# EAGLE design gimbal (EAGLE 6.5.0)
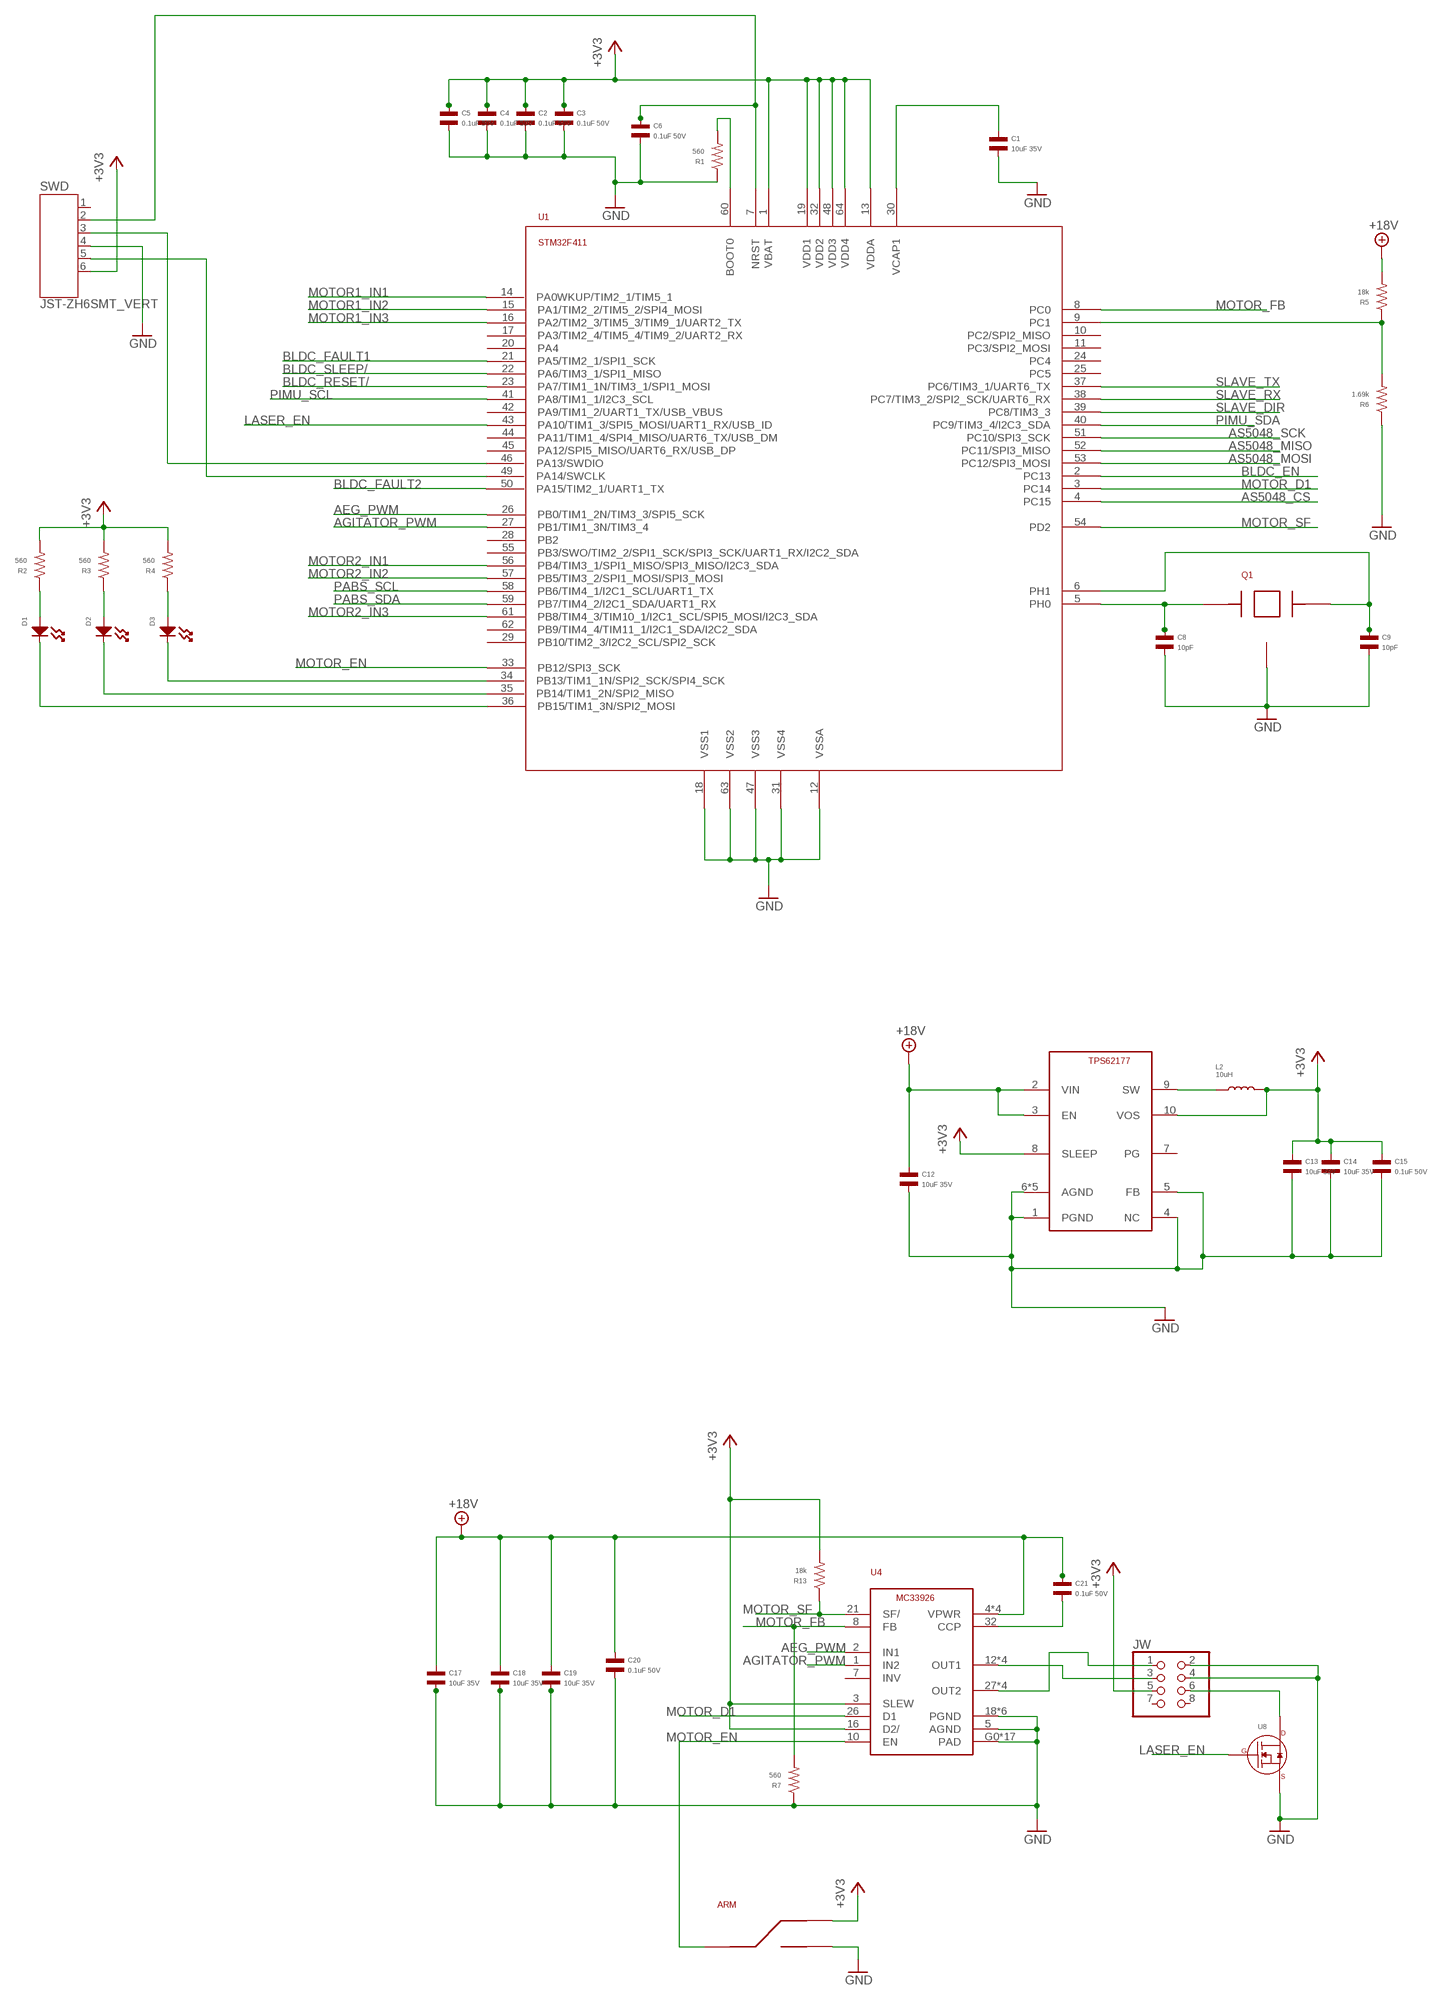
[diagram p0: schematic, sheet 1, part 1 of 2]
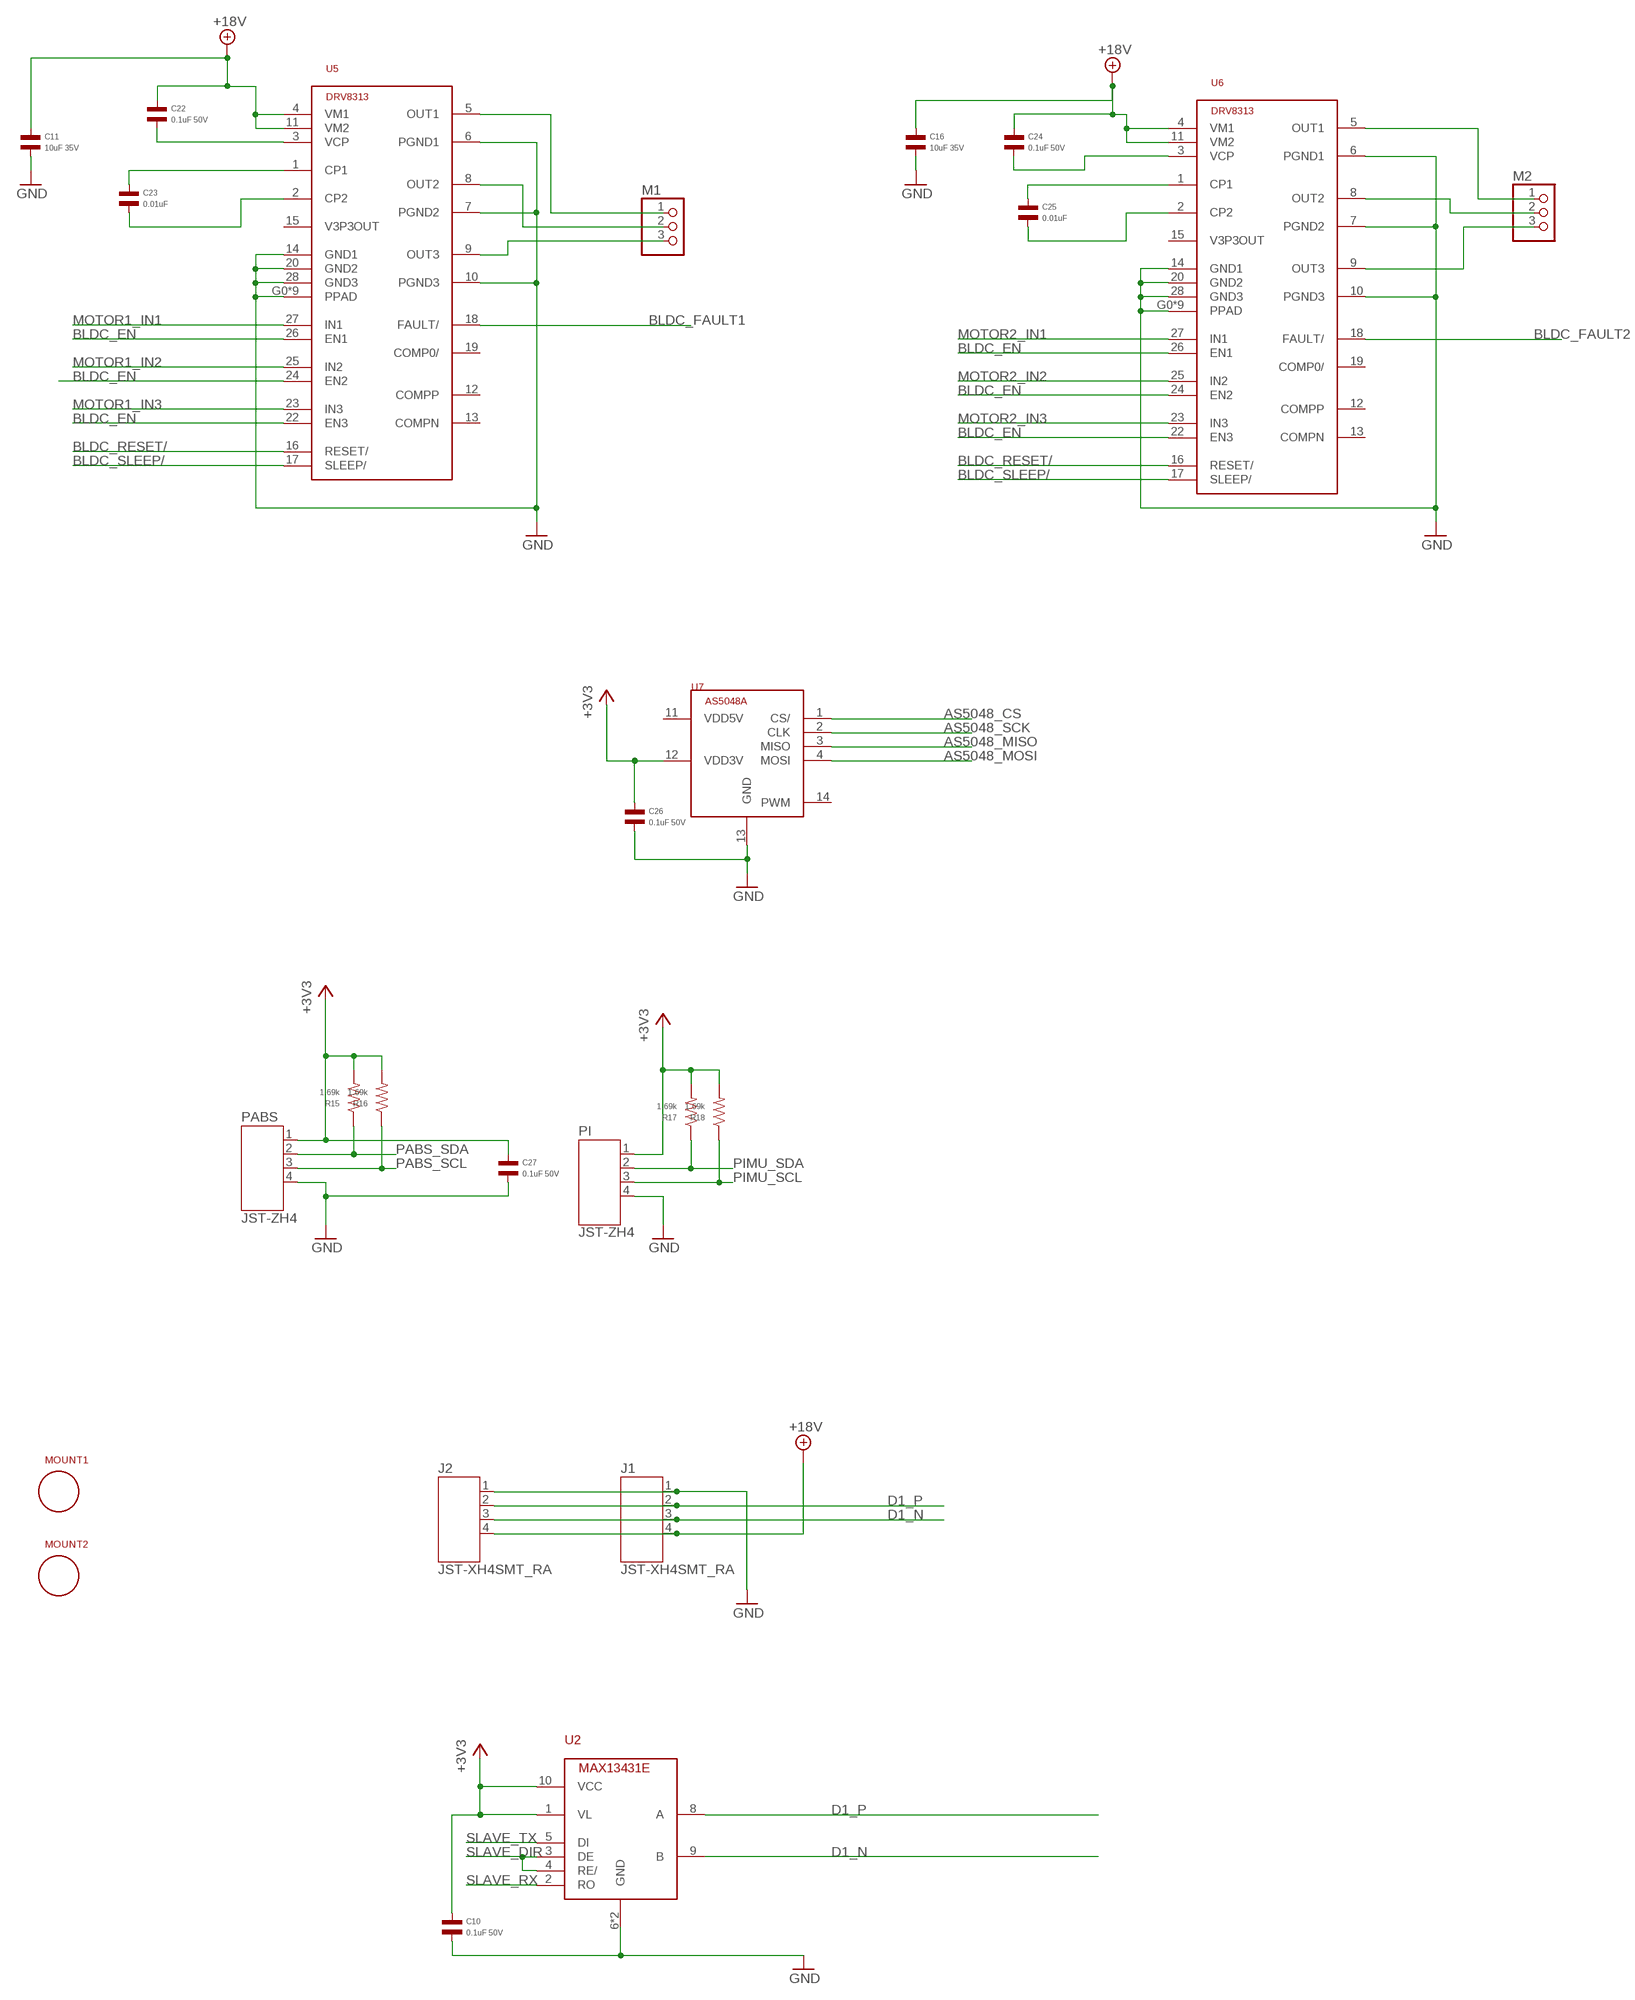
[diagram p1: schematic, sheet 1, part 2 of 2]

## Parts
ARM  SLIDE_SWITCHJS_SUB_SWITCH  [JS_SUB_SWITCH]
C1  10uF 35V  CAPACITOR_NP_1206  [C1206]
C2  0.1uF 50V  CAPACITOR_NP_0402  [C0402]
C3  0.1uF 50V  CAPACITOR_NP_0402  [C0402]
C4  0.1uF 50V  CAPACITOR_NP_0402  [C0402]
C5  0.1uF 50V  CAPACITOR_NP_0402  [C0402]
C6  0.1uF 50V  CAPACITOR_NP_0402  [C0402]
C8  10pF  CAPACITOR_NP_0603  [C0603]
C9  10pF  CAPACITOR_NP_0603  [C0603]
C10  0.1uF 50V  CAPACITOR_NP_0402  [C0402]
C11  10uF 35V  CAPACITOR_NP_1206  [C1206]
C12  10uF 35V  CAPACITOR_NP_1206  [C1206]
C13  10uF 35V  CAPACITOR_NP_1206  [C1206]
C14  10uF 35V  CAPACITOR_NP_1206  [C1206]
C15  0.1uF 50V  CAPACITOR_NP_0402  [C0402]
C16  10uF 35V  CAPACITOR_NP_1206  [C1206]
C17  10uF 35V  CAPACITOR_NP_1206  [C1206]
C18  10uF 35V  CAPACITOR_NP_1206  [C1206]
C19  10uF 35V  CAPACITOR_NP_1206  [C1206]
C20  0.1uF 50V  CAPACITOR_NP_0402  [C0402]
C21  0.1uF 50V  CAPACITOR_NP_0402  [C0402]
C22  0.1uF 50V  CAPACITOR_NP_0402  [C0402]
C23  0.01uF  CAPACITOR_NP_0603  [C0603]
C24  0.1uF 50V  CAPACITOR_NP_0402  [C0402]
C25  0.01uF  CAPACITOR_NP_0603  [C0603]
C26  0.1uF 50V  CAPACITOR_NP_0402  [C0402]
C27  0.1uF 50V  CAPACITOR_NP_0402  [C0402]
D1  LED_SINGLE-0603-RED  [LED0603]
D2  LED_SINGLE-0603-RED  [LED0603]
D3  LED_SINGLE-0603-RED  [LED0603]
J1  JST-XH4SMT_RA  [JST_XH_SMT_RA_4]
J2  JST-XH4SMT_RA  [JST_XH_SMT_RA_4]
JW  PINHD-2X4  [2X04]
L2  10uH  INDUCTOR_1210  [L1210]
M1  PINHD-1X3  [1X03]
M2  PINHD-1X3  [1X03]
MOUNT1  M3_MOTOR_MOUNT  [M3_MOTOR_MOUNT]
MOUNT2  M3_MOTOR_MOUNT  [M3_MOTOR_MOUNT]
PABS  JST-ZH4  [JST_ZH_SMT_VERT_4]
PI  JST-ZH4  [JST_ZH_SMT_VERT_4]
Q1  CRYSTALABM3B  [ABM3B]
R1  560  RESISTOR_0603  [R0603]
R2  560  RESISTOR_0603  [R0603]
R3  560  RESISTOR_0603  [R0603]
R4  560  RESISTOR_0603  [R0603]
R5  18k  RESISTOR_0603  [R0603]
R6  1.69k  RESISTOR_0603  [R0603]
R7  560  RESISTOR_0603  [R0603]
R13  18k  RESISTOR_0603  [R0603]
R15  1.69k  RESISTOR_0603  [R0603]
R16  1.69k  RESISTOR_0603  [R0603]
R17  1.69k  RESISTOR_0603  [R0603]
R18  1.69k  RESISTOR_0603  [R0603]
SWD  JST-ZH6SMT_VERT  [JST_B6B-ZR-SM4-TF(LF)(SN)]
U1  STM32F4R_64PIN  [LQFP64]
U2  MAX13431E  [TDFN10]
U3  TPS62177WSON10  [WSON10]
U4  MC33926  [PQFN32]
U5  DRV8313  [HTSSOP28]
U6  DRV8313  [HTSSOP28]
U7  AS5048A  [TSSOP14]
U8  N-CHANNEL_FET_SOT-23-3  [SOT-23-3]

## Nets
+3V3: ARM.1 C2.P$1 C3.P$1 C4.P$1 C5.P$1 C10.P$1 C13.P$1 C14.P$1 C15.P$1 C26.P$1 C27.P$1 JW.5 L2.P$2 PABS.1 PI.1 R2.P$2 R3.P$2 R4.P$2 R13.P$2 R15.P$2 R16.P$2 R17.P$2 R18.P$2 SWD.6 U1.1(VBAT) U1.13(VDDA) U1.19(VDD1) U1.32(VDD2) U1.48(VDD3) U1.64(VDD4) U2.1(VL) U2.10(VCC) U3.8(SLEEP) U3.10(VOS) U4.3(SLEW) U4.16(D2/) U7.12(VDD3V)
+18V: C11.P$1 C12.P$1 C16.P$1 C17.P$1 C18.P$1 C19.P$1 C20.P$1 C21.P$1 C22.P$1 C24.P$1 J1.4 J2.4 R5.P$2 U3.2(VIN) U3.3(EN) U4.4(VPWR) U4.6(VPWR) U4.11(VPWR) U4.31(VPWR) U5.4(VM1) U5.11(VM2) U6.4(VM1) U6.11(VM2)
AEG_PWM: U1.26(PB0/TIM1_2N/TIM3_3/SPI5_SCK) U4.2(IN1)
AGITATOR_PWM: U1.27(PB1/TIM1_3N/TIM3_4) U4.1(IN2)
AS5048_CS: U1.4(PC15) U7.1(CS/)
AS5048_MISO: U1.52(PC11/SPI3_MISO) U7.3(MISO)
AS5048_MOSI: U1.53(PC12/SPI3_MOSI) U7.4(MOSI)
AS5048_SCK: U1.51(PC10/SPI3_SCK) U7.2(CLK)
BLDC_EN: U1.2(PC13) U5.22(EN3) U5.24(EN2) U5.26(EN1) U6.22(EN3) U6.24(EN2) U6.26(EN1)
BLDC_FAULT1: U1.21(PA5/TIM2_1/SPI1_SCK) U5.18(FAULT/)
BLDC_FAULT2: U1.50(PA15/TIM2_1/UART1_TX) U6.18(FAULT/)
BLDC_RESET/: U1.23(PA7/TIM1_1N/TIM3_1/SPI1_MOSI) U5.16(RESET/) U6.16(RESET/)
BLDC_SLEEP/: U1.22(PA6/TIM3_1/SPI1_MISO) U5.17(SLEEP/) U6.17(SLEEP/)
D1_N: J1.3 J2.3 U2.9(B)
D1_P: J1.2 J2.2 U2.8(A)
GND: ARM.3 C1.P$2 C2.P$2 C3.P$2 C4.P$2 C5.P$2 C6.P$2 C8.P$2 C9.P$2 C10.P$2 C11.P$2 C12.P$2 C13.P$2 C14.P$2 C15.P$2 C16.P$2 C17.P$2 C18.P$2 C19.P$2 C20.P$2 C26.P$2 C27.P$2 J1.1 J2.1 JW.2 JW.4 PABS.4 PI.4 Q1.2 Q1.4 R1.P$1 R6.P$1 R7.P$1 SWD.4 U1.12(VSSA) U1.18(VSS1) U1.31(VSS4) U1.47(VSS3) U1.63(VSS2) U2.6(GND) U2.PAD(GND) U3.1(PGND) U3.4(NC) U3.5(FB) U3.6(AGND) U3.P0(AGND) U3.P1(AGND) U3.P2(AGND) U3.P3(AGND) U4.5(AGND) U4.18(PGND) U4.19(PGND) U4.20(PGND) U4.22(PGND) U4.23(PGND) U4.24(PGND) U4.G0(PAD) U4.G1(PAD) U4.G2(PAD) U4.G3(PAD) U4.G4(PAD) U4.G5(PAD) U4.G6(PAD) U4.G7(PAD) U4.G8(PAD) U4.G9(PAD) U4.G10(PAD) U4.G11(PAD) U4.G12(PAD) U4.G13(PAD) U4.G14(PAD) U4.G15(PAD) U4.G16(PAD) U5.6(PGND1) U5.7(PGND2) U5.10(PGND3) U5.14(GND1) U5.20(GND2) U5.28(GND3) U5.G0(PPAD) U5.G1(PPAD) U5.G2(PPAD) U5.G3(PPAD) U5.G4(PPAD) U5.G5(PPAD) U5.G6(PPAD) U5.G7(PPAD) U5.G8(PPAD) U6.6(PGND1) U6.7(PGND2) U6.10(PGND3) U6.14(GND1) U6.20(GND2) U6.28(GND3) U6.G0(PPAD) U6.G1(PPAD) U6.G2(PPAD) U6.G3(PPAD) U6.G4(PPAD) U6.G5(PPAD) U6.G6(PPAD) U6.G7(PPAD) U6.G8(PPAD) U7.13(GND) U8.P$2(SOURCE)
LASER_EN: U1.43(PA10/TIM1_3/SPI5_MOSI/UART1_RX/USB_ID) U8.P$1(GATE)
MOTOR1_IN1: U1.14(PA0WKUP/TIM2_1/TIM5_1) U5.27(IN1)
MOTOR1_IN2: U1.15(PA1/TIM2_2/TIM5_2/SPI4_MOSI) U5.25(IN2)
MOTOR1_IN3: U1.16(PA2/TIM2_3/TIM5_3/TIM9_1/UART2_TX) U5.23(IN3)
MOTOR2_IN1: U1.56(PB4/TIM3_1/SPI1_MISO/SPI3_MISO/I2C3_SDA) U6.27(IN1)
MOTOR2_IN2: U1.57(PB5/TIM3_2/SPI1_MOSI/SPI3_MOSI) U6.25(IN2)
MOTOR2_IN3: U1.61(PB8/TIM4_3/TIM10_1/I2C1_SCL/SPI5_MOSI/I2C3_SDA) U6.23(IN3)
MOTOR_D1: U1.3(PC14) U4.26(D1)
MOTOR_EN: ARM.2 U1.33(PB12/SPI3_SCK) U4.10(EN)
MOTOR_FB: R7.P$2 U1.8(PC0) U4.8(FB)
MOTOR_SF: R13.P$1 U1.54(PD2) U4.21(SF/)
N$1: JW.6 U8.P$3(DRAIN)
N$2: JW.3 U4.12(OUT1) U4.13(OUT1) U4.14(OUT1) U4.15(OUT1)
N$3: JW.1 U4.27(OUT2) U4.28(OUT2) U4.29(OUT2) U4.30(OUT2)
N$4: L2.P$1 U3.9(SW)
N$5: C21.P$2 U4.32(CCP)
N$6: M1.1 U5.5(OUT1)
N$7: M1.2 U5.8(OUT2)
N$8: M1.3 U5.9(OUT3)
N$9: M2.1 U6.5(OUT1)
N$10: M2.2 U6.8(OUT2)
N$11: M2.3 U6.9(OUT3)
N$23: C1.P$1 U1.30(VCAP1)
N$24: C6.P$1 SWD.2 U1.7(NRST)
N$25: C25.P$1 U6.1(CP1)
N$26: C25.P$2 U6.2(CP2)
N$27: C23.P$2 U5.2(CP2)
N$28: C23.P$1 U5.1(CP1)
N$29: C22.P$2 U5.3(VCP)
N$30: C24.P$2 U6.3(VCP)
N$31: SWD.5 U1.49(PA14/SWCLK)
N$32: SWD.3 U1.46(PA13/SWDIO)
N$33: R1.P$2 U1.60(BOOT0)
N$34: R5.P$1 R6.P$2 U1.9(PC1)
N$35: C8.P$1 Q1.1 U1.5(PH0)
N$36: C9.P$1 Q1.3 U1.6(PH1)
N$37: D2.CATHODE U1.35(PB14/TIM1_2N/SPI2_MISO)
N$39: D1.ANODE R2.P$1
N$40: D2.ANODE R3.P$1
N$41: D3.ANODE R4.P$1
N$42: D3.CATHODE U1.34(PB13/TIM1_1N/SPI2_SCK/SPI4_SCK)
N$43: D1.CATHODE U1.36(PB15/TIM1_3N/SPI2_MOSI)
PABS_SCL: PABS.3 R16.P$1 U1.58(PB6/TIM4_1/I2C1_SCL/UART1_TX)
PABS_SDA: PABS.2 R15.P$1 U1.59(PB7/TIM4_2/I2C1_SDA/UART1_RX)
PIMU_SCL: PI.3 R18.P$1 U1.41(PA8/TIM1_1/I2C3_SCL)
PIMU_SDA: PI.2 R17.P$1 U1.40(PC9/TIM3_4/I2C3_SDA)
SLAVE_DIR: U1.39(PC8/TIM3_3) U2.3(DE) U2.4(RE/)
SLAVE_RX: U1.38(PC7/TIM3_2/SPI2_SCK/UART6_RX) U2.2(RO)
SLAVE_TX: U1.37(PC6/TIM3_1/UART6_TX) U2.5(DI)
Unconnected: JW.7 JW.8 SWD.1 U1.10(PC2/SPI2_MISO) U1.11(PC3/SPI2_MOSI) U1.17(PA3/TIM2_4/TIM5_4/TIM9_2/UART2_RX) U1.20(PA4) U1.24(PC4) U1.25(PC5) U1.28(PB2) U1.29(PB10/TIM2_3/I2C2_SCL/SPI2_SCK) U1.42(PA9/TIM1_2/UART1_TX/USB_VBUS) U1.44(PA11/TIM1_4/SPI4_MISO/UART6_TX/USB_DM) U1.45(PA12/SPI5_MISO/UART6_RX/USB_DP) U1.55(PB3/SWO/TIM2_2/SPI1_SCK/SPI3_SCK/UART1_RX/I2C2_SDA) U1.62(PB9/TIM4_4/TIM11_1/I2C1_SDA/I2C2_SDA) U3.7(PG) U4.7(INV) U5.12(COMPP) U5.13(COMPN) U5.15(V3P3OUT) U5.19(COMP0/) U6.12(COMPP) U6.13(COMPN) U6.15(V3P3OUT) U6.19(COMP0/) U7.11(VDD5V) U7.14(PWM)

## Library data of the parts
ARM = gimbal:SLIDE_SWITCH; MPN: JS102011SAQN; POPULATE: 1
C1 C11-C14 C16-C19 = mfpassives:CAPACITOR_NP: Library: MF_Passives Description: Device for Non-Polarized Capacitors. Manufacture part number (MPN) can be added via Attributes. Check https://factory.macrofab.com/parts for the house parts list.; MF: TDK; MPN: CGA5L1X7R1V106M160AE; POPULATE: 1
C2-C6 C10 C15 C20-C22 C24 C26 C27 = mfpassives:CAPACITOR_NP: Library: MF_Passives Description: Device for Non-Polarized Capacitors. Manufacture part number (MPN) can be added via Attributes. Check https://factory.macrofab.com/parts for the house parts list.; MF: Walsin; MPN: 0402B104K500CT; POPULATE: 1
C8 C9 = mfpassives:CAPACITOR_NP: Library: MF_Passives Description: Device for Non-Polarized Capacitors. Manufacture part number (MPN) can be added via Attributes. Check https://factory.macrofab.com/parts for the house parts list.; HOUSEPART: YES; MPN: MF-CAP-0603-10pF; POPULATE: 1
C23 C25 = mfpassives:CAPACITOR_NP: Library: MF_Passives Description: Device for Non-Polarized Capacitors. Manufacture part number (MPN) can be added via Attributes. Check https://factory.macrofab.com/parts for the house parts list.; HOUSEPART: YES; MPN: MF-CAP-0603-0.01uF; POPULATE: 1
D1-D3 = mfleds:LED_SINGLE: Library: MF_LEDs Description: Device for Single LED Packages. Manufacture part number (MFG#) can be added via Attributes.; HOUSEPART: YES; MPN: MF-LED-0603-RED; POPULATE: 1; URL: https://factory.macrofab.com/part/MF-LED-0603-RED; VALUE: MF-LED-0603-RED
J1 J2 = gimbal:JST-XH4; MF: JST; MPN: S4B-XH-SM4-TB(LF)(SN); POPULATE: 1
JW = pinhead:PINHD-2X4: PIN HEADER; POPULATE: 0
L2 = mfpassives:INDUCTOR: Library: MF_Passives Description: Device for Inductors. Manufacture part number (MPN) can be added via Attributes. Check https://factory.macrofab.com/parts for the house parts list.; HOUSEPART: 1; MPN: MF-IND-1210-10uH; POPULATE: 1
M1 M2 = pinhead:PINHD-1X3: PIN HEADER; POPULATE: 0
MOUNT1 MOUNT2 = gimbal:M3_MOTOR_MOUNT; POPULATE: 0
PABS PI = gimbal:JST-ZH4; MF: JST; MPN: B4B-ZR-SM4-TF(LF)(SN); POPULATE: 1
Q1 = gimbal:CRYSTAL; MPN: ABM3B-8.000MHZ-10-1-U-T; POPULATE: 1
R1-R4 R7 = mfpassives:RESISTOR: Library: MF_Passives Description: Device for Resistors. Manufacture part number (MPN), Voltage, Tolerance, and Wattage Rating can be added via Attributes. Check https://factory.macrofab.com/parts for the house parts list.; HOUSEPART: YES; MPN: MF-RES-0603-560; POPULATE: 1
R5 R13 = mfpassives:RESISTOR: Library: MF_Passives Description: Device for Resistors. Manufacture part number (MPN), Voltage, Tolerance, and Wattage Rating can be added via Attributes. Check https://factory.macrofab.com/parts for the house parts list.; HOUSEPART: YES; MPN: MF-RES-0603-18K; POPULATE: 1
R6 R15-R18 = mfpassives:RESISTOR: Library: MF_Passives Description: Device for Resistors. Manufacture part number (MPN), Voltage, Tolerance, and Wattage Rating can be added via Attributes. Check https://factory.macrofab.com/parts for the house parts list.; HOUSEPART: YES; MPN: MF-RES-0603-1.69K; POPULATE: 1
SWD = controller:JST-ZH6; MF: JST; MPN: B6B-ZR-SM4-TF(LF)(SN); POPULATE: 1
U1 = gimbal:STM32F4R_64PIN: 64-pin STM32F4 chip.; MF: ST; MPN: STM32F411RET6; POPULATE: 1
U2 = controller:MAX13431E; MF: Maxim; MPN: MAX13431EETB+T; POPULATE: 1
U3 = imu_junction:TPS62177; MF: TI; MPN: TPS62177DQCR; POPULATE: 1
U4 = gimbal:MC33926; MF: Freescale; MPN: MC33926PNBR2; POPULATE: 1
U5 U6 = gimbal:DRV8313; MF: TI; MPN: DRV8313PWP; POPULATE: 1
U7 = gimbal:AS5048A; MF: AMS; MPN: AS5047P-ATSM; POPULATE: 1
U8 = mfdiscrete:N-CHANNEL_FET: Library: MF_Discrete_Semiconductor Description: Device for Single N-Channel Mosfet. Manufacture part number (MFG#) can be added via Attributes.; HOUSEPART: YES; MPN: MF-DSC-SOT233-BSS138; POPULATE: 1

## Board
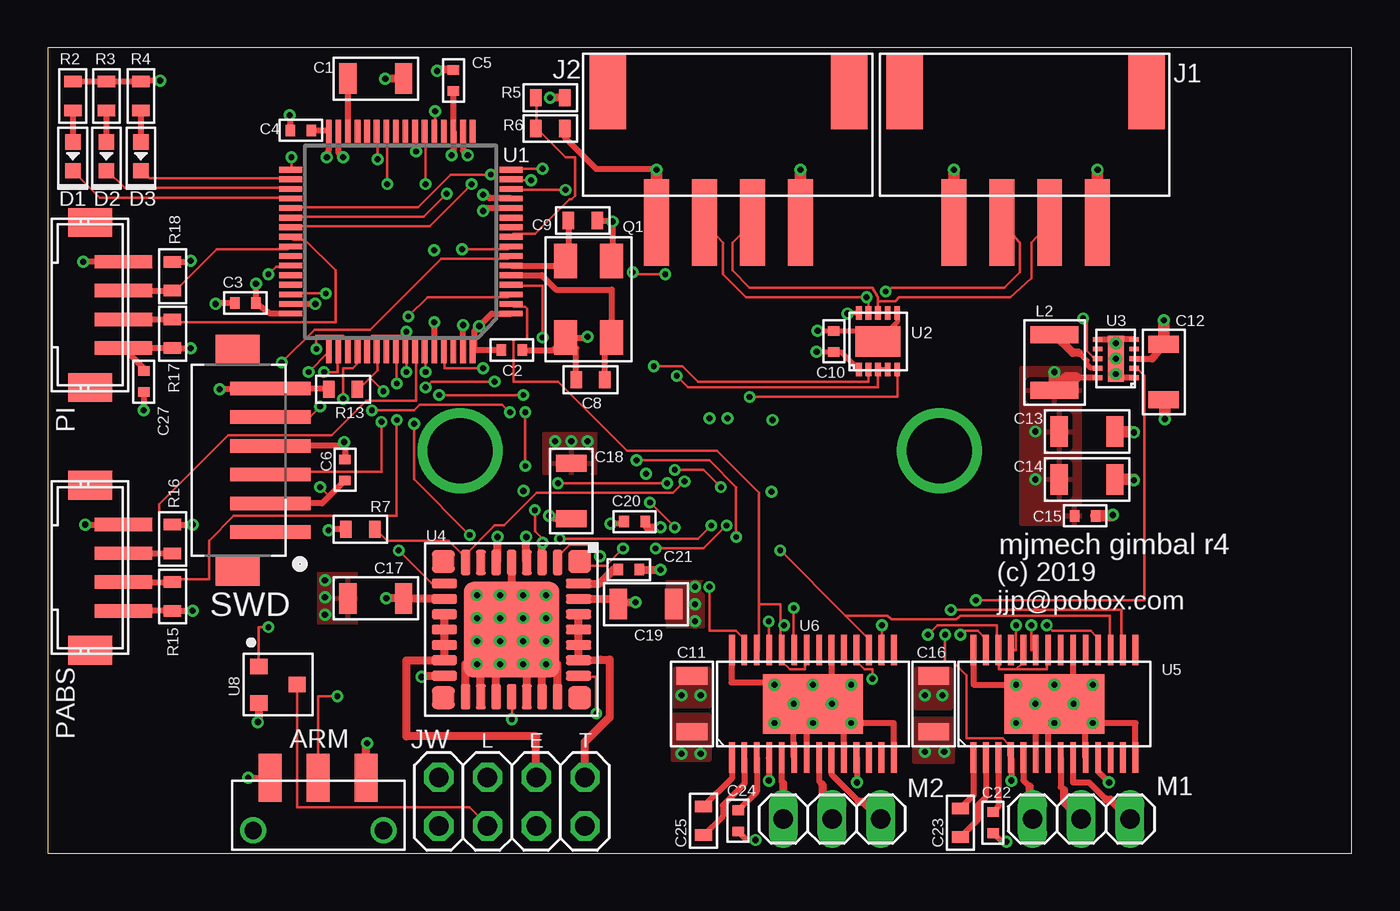
[diagram p2: board, top side]
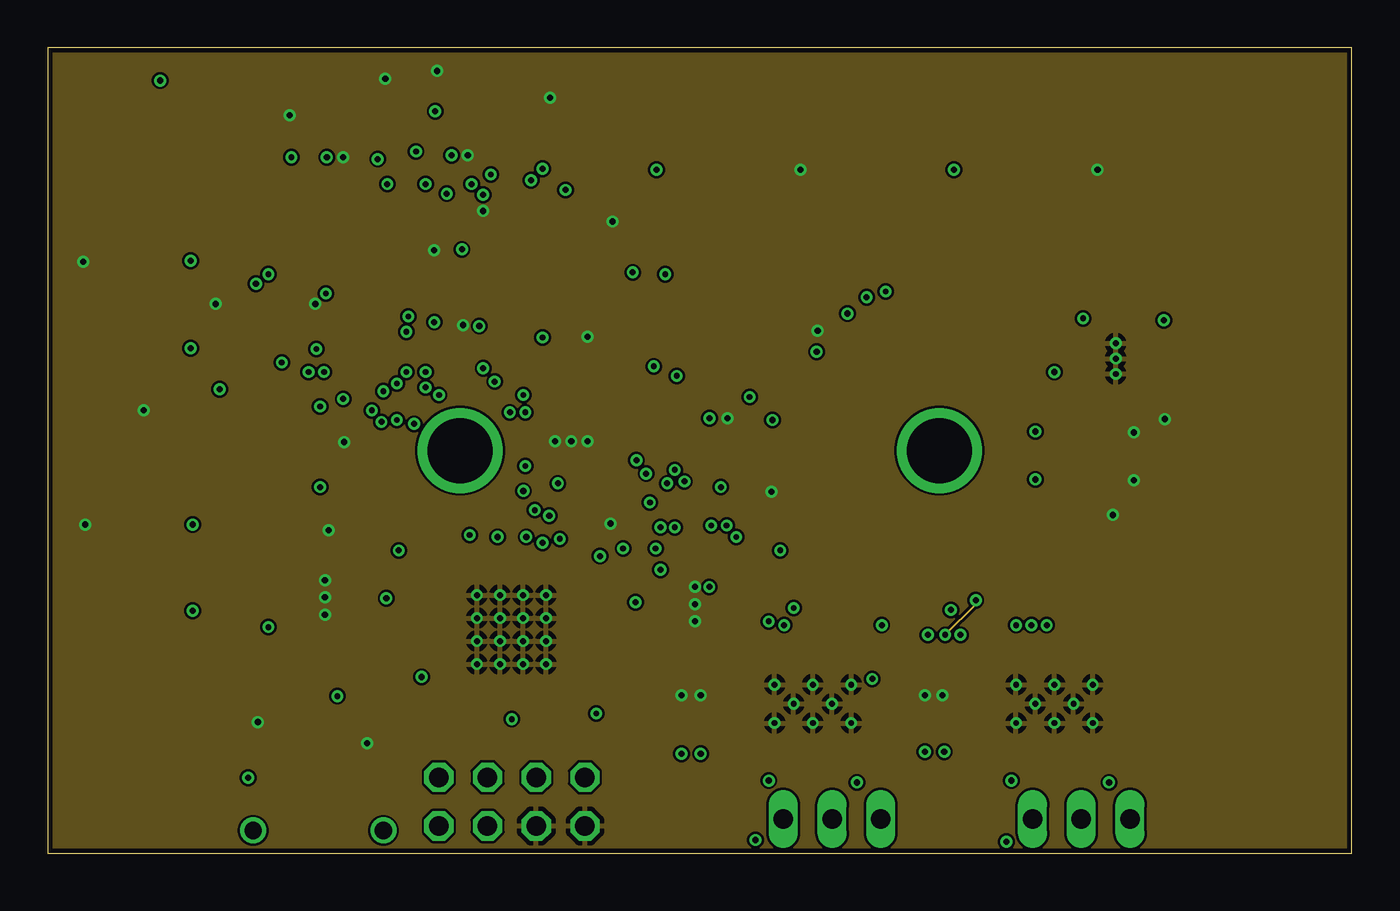
[diagram p3: board, inner layer Route2]
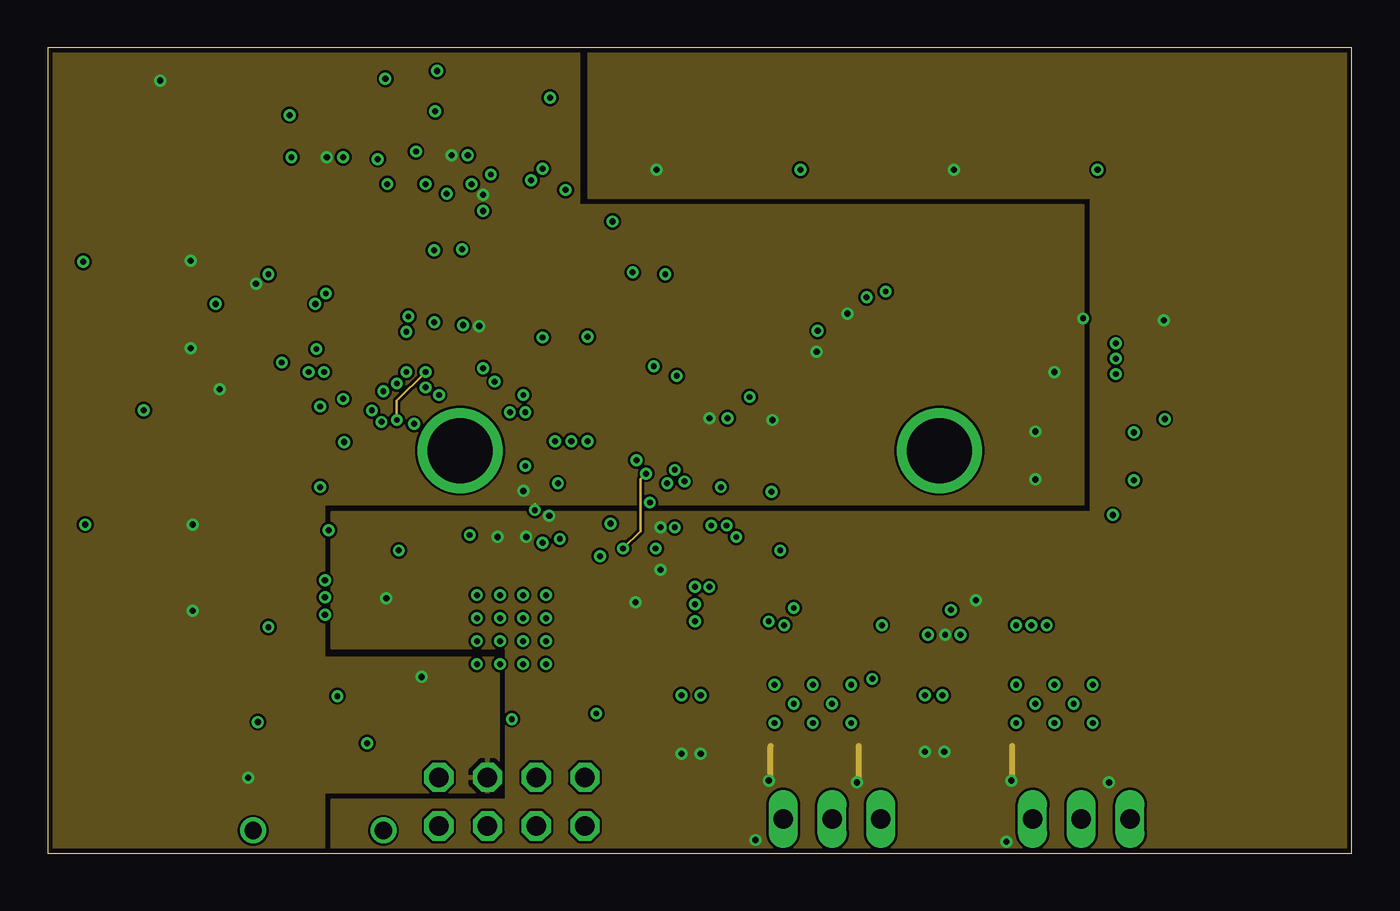
[diagram p4: board, inner layer Route15]
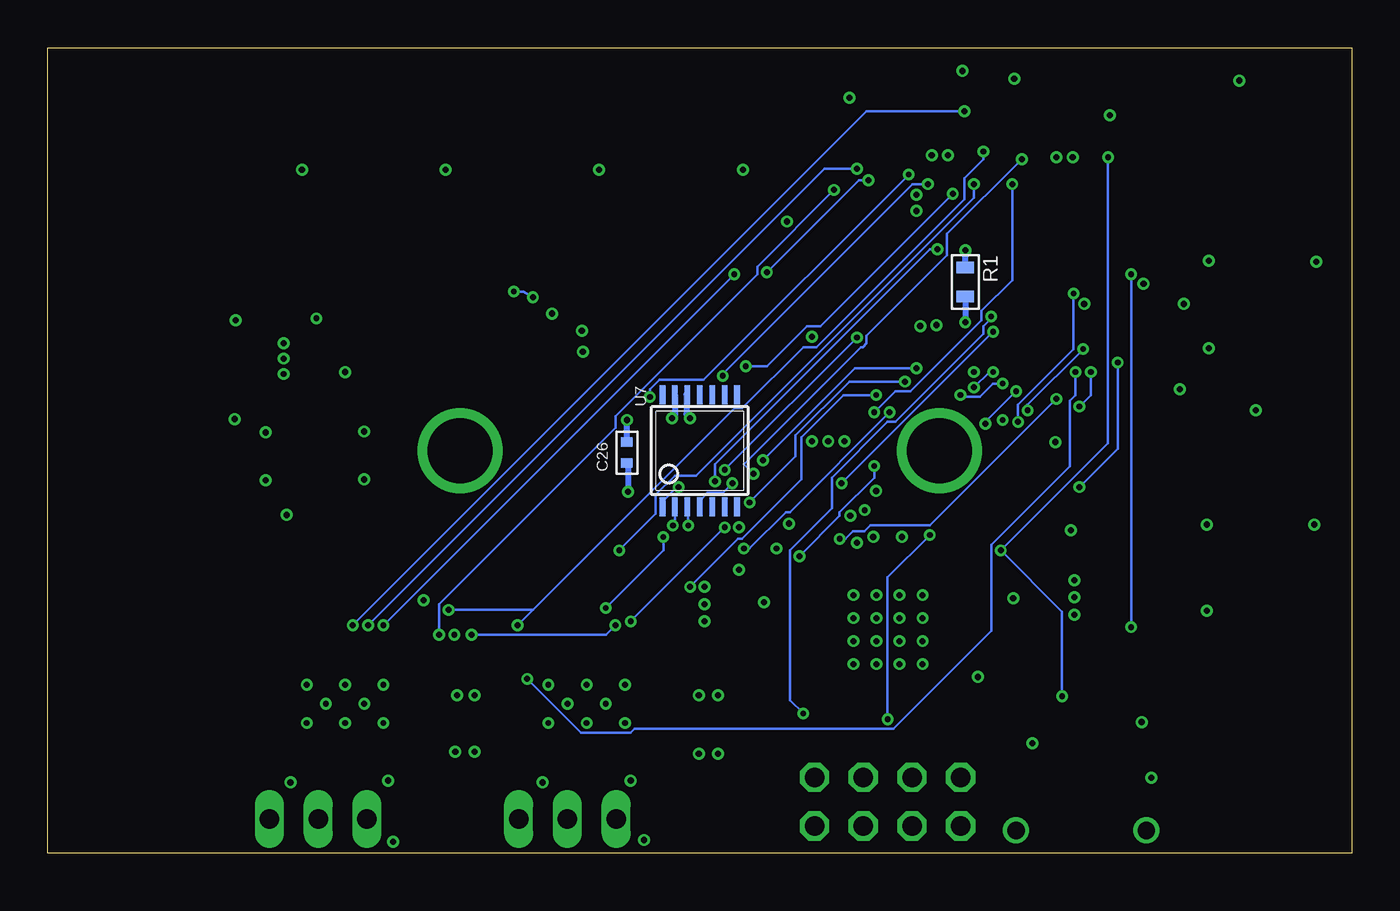
[diagram p5: board, bottom side, seen from below]

Size 68 x 42 mm. Coordinates in mm from the lower left corner, seen from the top.
Outline: 0,0 68,0 68,42 0,42 0,0
Copper layers (1*2*15*16): Top 0.035mm / dielectric 0.23mm / Route2 0.035mm / dielectric 0.93mm / Route15 0.035mm / dielectric 0.23mm / Bottom 0.035mm
Design rules "MF_Standard_4_Layer": minimum track width 5mil, minimum drill 12mil, track to track 5mil, track to pad 5mil, pad to pad 5mil, via to via 5mil, smd to smd 0mil, copper to edge 10mil, drill to drill 10mil, minimum pad ring 6mil, minimum via ring 6mil, stop-mask expansion 2mil, vias tented up to drill 25mil, thermal gap 10mil

### Footprints (pad centres in the part's own frame; a part is rotated, then mirrored left to right if it is on the bottom)
JS_SUB_SWITCH = smd 1.2 x 2.5: 1 -2.5,2.75; 2 0,2.75; 3 2.5,2.75 | drill 0.9: G0 -3.4,0; G1 3.4,0
C1206 = smd 0.9 x 1.6: P$1 -1.45,0; P$2 1.45,0
C0402 = smd 0.5 x 0.6: P$1 -0.55,0; P$2 0.55,0
C0603 = smd 0.6 x 0.9: P$1 -0.75,0; P$2 0.75,0
LED0603 = smd 0.8 x 0.8: ANODE 0.75,0; CATHODE -0.75,0
JST_XH_SMT_RA_4 = smd 1.3 x 4.5: 1 -3.75,4.6; 2 -1.25,4.6; 3 1.25,4.6; 4 3.75,4.6 | smd 1.9 x 3.9: SHLD1 -6.3,-2.2; SHLD2 6.3,-2.2
2X04 = drill 1.016 octagon: 1 -3.81,-1.27; 2 -3.81,1.27; 3 -1.27,-1.27; 4 -1.27,1.27; 5 1.27,-1.27; 6 1.27,1.27; 7 3.81,-1.27; 8 3.81,1.27
L1210 = smd 0.9 x 2.5: P$1 -1.45,0; P$2 1.45,0
1X03 = drill 1.016 long: 1 -2.54,0; 2 0,0; 3 2.54,0
M3_MOTOR_MOUNT = drill 3.4: P$1 0,0
JST_ZH_SMT_VERT_4 = smd 0.7 x 3: 1 -2.25,-0.75; 2 -0.75,-0.75; 3 0.75,-0.75; 4 2.25,-0.75 | smd 1.5 x 2.3: SHLD1 -4.3,1; SHLD2 4.3,1
ABM3B = smd 1.8 x 1.2: 1 -2,-1.2; 2 2,-1.2; 3 2,1.2; 4 -2,1.2
R0603 = smd 0.6 x 0.9: P$1 -0.75,0; P$2 0.75,0
JST_B6B-ZR-SM4-TF(LF)(SN) = smd 0.7 x 4.2: 1 -3.75,-2; 2 -2.25,-2; 3 -0.75,-2; 4 0.75,-2; 5 2.25,-2; 6 3.75,-2 | smd 1.5 x 2.3: P1 -5.8,-0.29; P2 5.8,-0.29
LQFP64 = smd 1.2 x 0.3: 1 -5.75,3.75; 2 -5.75,3.25; 3 -5.75,2.75; 4 -5.75,2.25; 5 -5.75,1.75; 6 -5.75,1.25; 7 -5.75,0.75; 8 -5.75,0.25; 9 -5.75,-0.25; 10 -5.75,-0.75; 11 -5.75,-1.25; 12 -5.75,-1.75; 13 -5.75,-2.25; 14 -5.75,-2.75; 15 -5.75,-3.25; 16 -5.75,-3.75; 33 5.75,-3.75; 34 5.75,-3.25; 35 5.75,-2.75; 36 5.75,-2.25; 37 5.75,-1.75; 38 5.75,-1.25; 39 5.75,-0.75; 40 5.75,-0.25; 41 5.75,0.25; 42 5.75,0.75; 43 5.75,1.25; 44 5.75,1.75; 45 5.75,2.25; 46 5.75,2.75; 47 5.75,3.25; 48 5.75,3.75 | smd 0.3 x 1.2: 17 -3.75,-5.75; 18 -3.25,-5.75; 19 -2.75,-5.75; 20 -2.25,-5.75; 21 -1.75,-5.75; 22 -1.25,-5.75; 23 -0.75,-5.75; 24 -0.25,-5.75; 25 0.25,-5.75; 26 0.75,-5.75; 27 1.25,-5.75; 28 1.75,-5.75; 29 2.25,-5.75; 30 2.75,-5.75; 31 3.25,-5.75; 32 3.75,-5.75; 49 3.75,5.75; 50 3.25,5.75; 51 2.75,5.75; 52 2.25,5.75; 53 1.75,5.75; 54 1.25,5.75; 55 0.75,5.75; 56 0.25,5.75; 57 -0.25,5.75; 58 -0.75,5.75; 59 -1.25,5.75; 60 -1.75,5.75; 61 -2.25,5.75; 62 -2.75,5.75; 63 -3.25,5.75; 64 -3.75,5.75
TDFN10 = smd 0.7 x 0.3: 1 -1.475,1; 2 -1.475,0.5; 3 -1.475,0; 4 -1.475,-0.5; 5 -1.475,-1; 6 1.475,-1; 7 1.475,-0.5; 8 1.475,0; 9 1.475,0.5; 10 1.475,1 | smd 1.58 x 2.35: PAD 0,0
WSON10 = smd 0.5 x 0.25: 1 -0.95,1; 2 -0.95,0.5; 3 -0.95,0; 4 -0.95,-0.5; 5 -0.95,-1; 6 0.95,-1; 7 0.95,-0.5; 8 0.95,0; 9 0.95,0.5; 10 0.95,1 | smd 0.84 x 2.4: P0 0,0 | drill 0.305: P1 0,0.8; P2 0,0; P3 0,-0.8
PQFN32 = smd 1.2 x 1.2: 1 -3.55,3.55; 9 -3.55,-3.55; 17 3.55,-3.55; 25 3.55,3.55 | smd 1.3 x 0.5: 2 -3.5,2.4; 3 -3.5,1.6; 4 -3.5,0.8; 5 -3.5,0; 6 -3.5,-0.8; 7 -3.5,-1.6; 8 -3.5,-2.4; 18 3.5,-2.4; 19 3.5,-1.6; 20 3.5,-0.8; 21 3.5,0; 22 3.5,0.8; 23 3.5,1.6; 24 3.5,2.4 | smd 0.5 x 1.3: 10 -2.4,-3.5; 11 -1.6,-3.5; 12 -0.8,-3.5; 13 0,-3.5; 14 0.8,-3.5; 15 1.6,-3.5; 16 2.4,-3.5; 26 2.4,3.5; 27 1.6,3.5; 28 0.8,3.5; 29 0,3.5; 30 -0.8,3.5; 31 -1.6,3.5; 32 -2.4,3.5 | smd 5 x 5: G0 0,0 | drill 0.305: G1 -1.8,1.8; G2 -0.6,1.8; G3 0.6,1.8; G4 1.8,1.8; G5 -1.8,0.6; G6 -0.6,0.6; G7 0.6,0.6; G8 1.8,0.6; G9 -1.8,-0.6; G10 -0.6,-0.6; G11 0.6,-0.6; G12 1.8,-0.6; G13 -1.8,-1.8; G14 -0.6,-1.8; G15 0.6,-1.8; G16 1.8,-1.8
HTSSOP28 = smd 1.6 x 0.3: 1 -2.8,4.225; 2 -2.8,3.575; 3 -2.8,2.925; 4 -2.8,2.275; 5 -2.8,1.625; 6 -2.8,0.975; 7 -2.8,0.325; 8 -2.8,-0.325; 9 -2.8,-0.975; 10 -2.8,-1.625; 11 -2.8,-2.275; 12 -2.8,-2.925; 13 -2.8,-3.575; 14 -2.8,-4.225; 15 2.8,-4.225; 16 2.8,-3.575; 17 2.8,-2.925; 18 2.8,-2.275; 19 2.8,-1.625; 20 2.8,-0.975; 21 2.8,-0.325; 22 2.8,0.325; 23 2.8,0.975; 24 2.8,1.625; 25 2.8,2.275; 26 2.8,2.925; 27 2.8,3.575; 28 2.8,4.225 | smd 3.1 x 5.2: G0 0,0 | drill 0.305: G1 -1,2; G2 1,2; G3 0,1; G4 -1,0; G5 1,0; G6 0,-1; G7 -1,-2; G8 1,-2
TSSOP14 = smd 0.305 x 0.991: 1 -1.95,-2.918; 2 -1.3,-2.918; 3 -0.65,-2.918; 4 0,-2.918; 5 0.65,-2.918; 6 1.3,-2.918; 7 1.95,-2.918; 8 1.95,2.918; 9 1.3,2.918; 10 0.65,2.918; 11 0,2.918; 12 -0.65,2.918; 13 -1.3,2.918; 14 -1.95,2.918
SOT-23-3 = smd 0.8 x 0.9: P$1 -0.95,-1; P$2 0.95,-1; P$3 0,1

### Placement (x,y rotation side)
ARM  14.1,1.2 0 top
C1  17.1,40.4 0 top
C2  24.2,26.25 0 top
C3  10.3,28.7 180 top
C4  13.2,37.7 180 top
C5  21.15,40.3 90 top
C6  15.5,20 90 top
C8  28.3,24.7 180 top
C9  27.9,33 0 top
C10  41,26.7 90 top
C11  33.6,7.8 90 top
C12  58.2,25.1 270 top
C13  54.2,22 0 top
C14  54.2,19.5 0 top
C15  54.1,17.6 0 top
C16  46.2,7.8 90 top
C17  17.1,13.3 180 top
C18  27.3,18.9 90 top
C19  31.2,13 0 top
C20  30.6,17.3 180 top
C21  30.3,14.8 180 top
C22  49.3,1.6 90 top
C23  47.6,1.6 270 top
C24  36,1.7 90 top
C25  34.2,1.7 270 top
C26  37.8,20.9 270 bottom
C27  5,24.6 270 top
D1  1.3,36.35 90 top
D2  3.05,36.35 90 top
D3  4.85,36.35 90 top
J1  51,37.5 180 top
J2  35.5,37.5 180 top
JW  24.2,2.7 180 top
L2  52.5,25.6 270 top
M1  53.9,1.8 0 top
M2  40.9,1.8 0 top
MOUNT1  46.5,21 0 top
MOUNT2  21.5,21 0 top
PABS  3.2,14.9 90 top
PI  3.2,28.6 90 top
Q1  28.2,28.9 90 top
R1  20.15,29.8 270 bottom
R2  1.3,39.5 90 top
R3  3.05,39.5 90 top
R4  4.85,39.5 90 top
R5  26.2,37.8 0 top
R6  26.2,39.4 180 top
R7  16.3,16.9 0 top
R13  15.4,24.2 180 top
R15  6.5,13.4 270 top
R16  6.5,16.4 90 top
R17  6.5,27.1 270 top
R18  6.5,30.1 90 top
SWD  9.6,20.5 90 top
U1  18.4,31.9 180 top
U2  43.3,26.7 90 top
U3  55.7,25.8 180 top
U4  24.18,11.67 270 top
U5  52.5,7.8 90 top
U6  39.9,7.8 90 top
U7  34,21 0 bottom
U8  12,8.8 270 top

### Tracks (layer width: path | path; a pad name or v marks a point on that pad's centre or on a via)
+3V3  (via drill 0.3, 0.32)
  Top 0.127: v54,27.9 54.2,27.9 54.2,26.2 54.5,25.9 54.6,25.9 54.7,25.8 U3.8 | v25.4,17.9 25.4,16.8 25.8,16.4 v25.8,16.2
  Top 0.254: U2.10 41.73,28.18 v41.7,28.15 | v40.1,26.15 C10.P$1 41.38,26.15 U2.1
  Top 0.305: C5.P$1 U1.19 21.15,36.7 v21.05,36.4 | C2.P$1 22.25,26.25 | 22.25,26.25 U1.64 | 22.25,26.25 22.25,27.25 v22.5,27.5 23.15,28.15 U1.1 | U1.13 23.05,34.15 22.85,34.35 v22.7,34.35 | v14.55,36.3 14.65,36.7 U1.32 14.6,37.7 C4.P$1 | U1.48 11.6,28.15 C3.P$1 v10.85,29.7 | 3.95,26.3 PI.1 | 3.95,12.6 PABS.1 R15.P$2 v7.55,12.65 | U3.10 53.6,24.8 | v5.85,40.3 4.9,40.3 R4.P$2 R3.P$2 R2.P$2 | R18.P$2 7.4,30.85 v7.45,30.9 | v7.45,26.35 R17.P$2 PI.1 | R16.P$2 v7.55,17.15 | C27.P$1 5,25.3 PI.1 | v10.45,3.95 ARM.1 | v8.95,24.2 11.55,24.2 SWD.6 14.6,24.25 R13.P$2
  Top 0.406: v19.5,9.2 19.5,9.27 U4.16 | U4.3 25.78,16.2 v25.8,16.2
  Top 0.61: 53.6,24.8 53.15,24.8 L2.P$2 v52.5,25.1
  Route15 0.127: v25.4,17.9 25.4,18.2
  Bottom 0.305: U7.12 34.7,23.92 34.7,22.9 v34.5,22.7 | C26.P$1 v37.8,22.6
  other vias: 51.5,22 51.5,19.5 24.8,18.9
  pour Route15: 0.2,41.8 27.7,41.8 27.7,33.8 54,33.8 54,18.2 14.4,18.2 14.4,10.2 23.5,10.2 23.5,3.2 14.4,3.2 14.4,0.2 0.2,0.2
  pour Top: 50.8,25.3 53.8,25.3 53.8,17.2 50.8,17.2
+18V  (via drill 0.3, 0.32)
  Top 0.127: 56.7,25.3 56.7,25.7 U3.3 | 56.7,25.3 56.8,25.2 56.9,25.2 57.2,24.9 57.2,13.2 v48.4,13.2 | v46.8,11.4 46.8,10 47.2,10 47.9,9.3 47.9,6 49.8,6 50.1,5.7 50.1,5.1 50.2,5 U5.4 | 56.7,25.3 U3.2
  Top 0.305: 50.25,4.97 v50.25,3.8 | U6.11 42.2,4.97 v42.2,3.7 | U6.4 37.6,4.97 v37.6,3.8 | U3.3 57.6,25.8 | R5.P$2 26.95,37.35 28.6,35.7 31.7,35.7 v31.75,35.65 | C24.P$1 36.45,0.7 v36.9,0.7 | C22.P$1 49.75,0.6 v50,0.6 | U5.11 54.77,4.28 v55.35,3.7
  Top 0.406: U4.31 29.48,13.27 C19.P$1 29.85,13.1 v30.65,13.1 | U4.11 18.58,13.27 C17.P$1 v17.65,13.3 | 57.6,25.8 C12.P$1 | C18.P$1 26.95,17.3 v26.15,17.6 | U4.6 23.45,15.24 v23.45,16.5 | U4.4 24.95,15.2 v24.95,16.5 | C20.P$1 31.25,17 v31.95,17 | C21.P$1 v31.95,14.8
  Top 0.61: J2.4 v31.75,35.65 | J1.4 v47.25,35.65 | C12.P$1 v58.2,27.8
  Route2 0.127: v48.4,13.2 48.4,13 v46.8,11.4
  Route15 0.305: v50.25,3.8 50.3,3.85 50.3,5.6 | v42.2,3.7 42.3,3.8 42.3,5.6 | v37.6,3.8 37.7,3.9 37.7,5.6
  other vias: 45.75,5.3 46.75,5.3 33.05,5.2 34.05,5.2
  pour Route15: 28.2,41.8 67.8,41.8 67.8,0.2 14.8,0.2 14.8,2.8 23.9,2.8 23.9,10.7 14.8,10.7 14.8,17.8 54.4,17.8 54.4,34.2 28.2,34.2
  pour Top (no thermals): 45.2,7 45.2,4.8 47.2,4.8 47.2,7
  pour Top (no thermals): 32.6,7.2 32.6,4.9 34.5,4.9 34.5,7.2
AEG_PWM  (via drill 0.3)
  Top 0.127: v17.7,34.9 17.7,37.6 U1.26 | v24.9,20.2 v24.9,23 | v28.8,15.5 28.2,16.1 27.2,16.1 26.6,15.5 26.6,15.2 U4.2
  Bottom 0.127: v17.7,34.9 17.7,29.9 19.3,28.3 19.3,27.8 23,24.1 23.8,24.1 v24.9,23 | v24.9,20.2 24.9,19.6 26.7,17.8 26.7,17.6 v28.8,15.5
AGITATOR_PWM  (via drill 0.3)
  Top 0.127: v30,15.9 29.1,15 28,15 27.8,15.2 U4.1 | v17.2,36.2 17.2,37.6 U1.27
  Route15 0.127: v30,15.9 30.9,16.8 30.9,19.5 v31.2,19.8
  Bottom 0.127: v31.2,19.8 31.7,20.3 25.6,26.4 25.5,26.4 25.3,26.6 25.3,27 21.1,31.2 21.1,32.3 v17.2,36.2
AS5048_CS  (via drill 0.3)
  Top 0.127: v35.1,19.1 34.2,20 v32.7,20 | v25.8,26.9 25.8,29.6 24.2,29.6 U1.4
  Bottom 0.127: v35.1,19.1 35.2,19.1 35.9,18.4 35.9,18.1 U7.1 | v25.8,26.9 v32.7,20
AS5048_MISO  (via drill 0.3)
  Top 0.127: v34.6,17.1 33.9,16.4 v26.7,16.4 | v15.4,23.7 15.4,25.3 15.9,25.3 16.1,25.5 16.1,26.1 U1.52
  Bottom 0.127: v34.6,17.1 34.6,18 U7.3 | v26.7,16.4 26.4,16.4 26,16.8 25.4,16.8 25.1,17.1 22,17.1 v15.4,23.7
AS5048_MOSI  (via drill 0.3)
  Top 0.127: v26.6,19.3 v32.3,19.3 | v18.7,27.2 18.5,27 16.9,27 16.7,26.8 16.7,26.2 U1.53
  Bottom 0.127: U7.4 34,18.4 33.6,18.8 32.8,18.8 v32.3,19.3 | v18.7,27.2 v26.6,19.3
AS5048_SCK  (via drill 0.3)
  Top 0.127: v35.4,17.1 34.2,15.9 v31.7,15.9 | v24.1,23 23.7,23.4 19.4,23.4 19.1,23.1 v16.9,23.1 | v14,26.3 14,27 15.4,27 15.6,26.8 15.6,26.2 U1.51
  Bottom 0.127: U7.2 35.3,17.2 v35.4,17.1 | v31.7,15.9 31.4,15.9 29.5,17.8 29.3,17.8 v24.1,23 | v16.9,23.1 16.9,23.4 v14,26.3
BLDC_EN  (via drill 0.3)
  Top 0.127: 50.5,9.6 49.6,9.6 49.6,10.6 U5.26 49.5,10.6 49.5,11.9 46.4,11.9 v45.9,11.4 | 50.5,9.6 50.8,9.9 50.8,10.6 U5.24 | 50.5,9.6 52.1,9.6 52.1,10.6 U5.22 | U1.2 24.3,28.5 24.9,28.5 25,28.4 25,26.8 24.4,26.8 24.3,26.7 24.3,24.6 26.6,24.6 30.2,21 34.9,21 37.1,18.8 37.1,13 | 37.1,13 37.1,10.6 U6.26 | 38.2,11.9 38.2,13 37.1,13 | 38.2,11.9 38.2,10.6 U6.24 38.3,10.6 38.3,10 38.7,9.6 39.5,9.6 39.5,10.6 U6.22 | 38.2,11.9 v38.4,11.9
  Bottom 0.127: v45.9,11.4 38.9,11.4 v38.4,11.9
BLDC_FAULT1  (via drill 0.3)
  Top 0.127: v20.2,38.7 20.2,37.7 U1.21 | v52.1,11.9 52.4,11.6 54.4,11.6 54.7,11.3 54.7,10.6 U5.18
  Bottom 0.127: v20.2,38.7 25.3,38.7 v52.1,11.9
BLDC_FAULT2  (via drill 0.3)
  Top 0.127: v14.4,25.1 15.1,25.1 15.1,26.1 U1.50 | v43,9.1 43,9.6 42.6,9.6 42.2,10 42.2,10.6 U6.18
  Bottom 0.127: v14.4,25.1 14.4,23.9 14.7,23.6 14.7,20.2 18.8,16.1 18.8,11.6 23.9,6.5 37.4,6.5 37.6,6.3 40.2,6.3 v43,9.1
BLDC_RESET/  (via drill 0.3)
  Top 0.127: v19.2,36.6 19.2,37.6 U1.23 | v43.5,11.9 43.5,10.6 U6.16 | v47.1,12.7 56,12.7 56,10.6 U5.16
  Bottom 0.127: v19.2,36.6 19.2,36.2 20.2,35.2 20.2,34.1 27.9,26.4 28.6,26.4 31.8,23.2 32.2,23.2 42.7,12.7 | v43.5,11.9 42.7,12.7 | 42.7,12.7 v47.1,12.7
BLDC_SLEEP/  (via drill 0.3)
  Top 0.127: v19.7,34.9 19.7,37.6 U1.22 | 41.6,12.4 42.8,11.2 42.8,10.6 U6.17 | 41.6,12.4 v38.2,15.8 | 41.6,12.4 43.8,12.4 44,12.2 47.4,12.2 47.6,12.4 55.4,12.4 55.4,10.6 U5.17
  Bottom 0.127: v19.7,34.9 19.7,34.2 34.2,19.7 35.3,19.7 36.3,18.7 36.3,17.7 v38.2,15.8
D1_N  (via drill 0.3)
  Top 0.127: J2.3 35.2,31.85 35.2,30.2 36.4,29 v42.7,29 42.8,29 U2.9 | v43.7,29.3 44,29.5 49.9,29.5 50.7,30.3 50.7,31.85 J1.3
  Bottom 0.127: v42.7,29 43.2,29.3 v43.7,29.3
D1_P
  Top 0.127: 43.3,28.8 43.3,29 43,29.5 36.6,29.5 35.7,30.4 35.7,31.85 J2.2 | U2.8 43.3,28.8 | 43.3,28.8 44.2,28.8 44.4,29 50.2,29 51.3,30 51.3,31.85 J1.2
GND  (via drill 0.32)
  Top 0.127: U3.4 56.7,26.3 56.7,26.7 U3.5
  Top 0.254: v40.15,27.25 C10.P$2 42.75,27.25 U2.PAD 44.3,27.7 U2.6
  Top 0.305: C9.P$2 29.4,33 v29.45,32.95 29.45,30.95 Q1.2 | Q1.4 28.1,26.9 v28.15,26.95 | C8.P$2 27.55,26.35 Q1.4 | C2.P$2 26.35,26.25 Q1.4 | U1.63 v21.65,27.55 | U1.31 15.15,36.55 v15.4,36.3 | U1.18 21.65,36.65 v21.9,36.4 | C3.P$2 8.8,28.7 v8.75,28.65 | U1.47 v13.95,28.65 | U6.G2 37.8,8.9 35.65,8.9 35.67,8.93 U6.28 | U6.G4 39.58,6.47 U6.7 | U6.6 38.9,5.03 U6.G3 U6.G0 | U6.10 41.52,6.8 U6.G7 44.12,6.8 U6.14 | U5.7 52.17,6.8 U5.G4 | U5.6 51.52,7.8 | 51.52,7.8 U5.G3 | U5.10 54.12,6.8 U5.G7 56.73,6.8 U5.14 | U5.20 53.48,8.8 U5.G5 | U5.28 48.27,8.8 U5.G2 | U6.20 40.88,7.8 U6.G6 | 51.52,7.8 U5.G0 | v1.95,17.15 1.95,17.1 1.9,17.1 1.9,17.15 PABS.4 | PI.4 v1.85,30.85 | C27.P$2 v5,23.1 | v29.35,17.2 29.55,17.2 C20.P$2 | U1.12 22.85,33.65 v22.7,33.5 | U3.1 55.9,24.8 arc-90 U3.P1 | U3.5 55.9,26.8 arc90 U3.P3 arc90 55.5,26.8 U3.6 | C4.P$2 12.65,38.45 v12.6,38.5 | R7.P$1 14.7,16.9 v14.65,16.85 | SWD.4 15.25,21.25 v15.45,21.45 15.5,21.4 C6.P$2
  Top 0.406: U4.18 21.78,9.87 U4.G16 22.58,9.87 U4.19 | U4.24 26.58,9.87 U4.G4 25.78,9.87 U4.23 | U4.22 24.98,9.87 U4.G8 | U4.20 23.38,9.87 U4.G12 | U4.5 24.18,13.47 U4.G5 | U4.G10 23.58,11.67 U4.G0 | ARM.3 16.6,5.75 v16.65,5.75 | U8.P$2 11,6.85 v10.95,6.85 | C1.P$2 v17.6,40.4 | C5.P$2 20.35,40.85 v20.3,40.8 | R6.P$1 v26.2,39.4
  Top 0.61: J2.1 v39.25,35.65 | J1.1 v54.75,35.65 | C12.P$2 58.25,23.65 v58.25,22.65 | C13.P$2 56.65,22 v56.65,21.95 | C14.P$2 56.65,19.5 v56.65,19.45 | C15.P$2 55.5,17.6 v55.55,17.65
  Bottom 0.305: C26.P$2 37.75,20.15 v37.75,18.85 | U7.13 35.3,22.85 v35.45,22.7 | R1.P$1 v20.15,31.45
  other vias: 26.45,21.5 27.3,21.5 28.15,21.5 14.45,14.25 14.45,13.35 14.45,12.45 33.75,13.9 33.75,13 33.75,12.1 45.75,8.25 46.65,8.25 33.05,8.25 34.05,8.25
  pour Route2: 0.2,41.8 67.8,41.8 67.8,0.2 0.2,0.2
  pour Top: 25.85,21.9 25.85,19.8 28.6,19.8 28.6,21.9
  pour Top: 14.1,14.6 16.1,14.6 16.1,12 14.1,12
  pour Top (no thermals): 32.3,14.2 34.2,14.2 34.2,11.8 32.3,11.8
  pour Top (no thermals): 45.3,9.6 45.3,7.6 47.1,7.6 47.1,9.6
  pour Top (no thermals): 32.7,9.6 32.7,7.7 34.5,7.7 34.5,9.6
LASER_EN  (via drill 0.3)
  Top 0.127: U8.P$1 11,11.8 v11.5,11.8 | v11.5,30.2 11.9,30.6 12.6,30.6 U1.43
  Bottom 0.127: v11.5,30.2 v11.5,11.8
MOTOR1_IN1  (via drill 0.3)
  Top 0.127: v27,34.6 24.2,34.6 U1.14 | v47.6,11.4 47.8,11.6 48.5,11.6 48.9,11.2 48.9,10.6 U5.27
  Bottom 0.127: v27,34.6 31,30.6 31,30.2 38.4,22.8 38.4,22.2 47.6,13 v47.6,11.4
MOTOR1_IN2  (via drill 0.3)
  Top 0.127: v25.2,35.1 24.2,35.1 U1.15 | v30.5,30.3 30.6,30.2 v32.2,30.2 | v50.5,11.9 50.5,10.6 U5.25
  Bottom 0.127: v25.2,35.1 25.7,35.1 v30.5,30.3 | v50.5,11.9 v32.2,30.2
MOTOR1_IN3  (via drill 0.3)
  Top 0.127: v25.8,35.7 24.2,35.7 U1.16 | v51.3,11.9 51.3,10.6 U5.23
  Bottom 0.127: v25.8,35.7 27.5,35.7 v51.3,11.9
MOTOR2_IN1  (via drill 0.3)
  Top 0.127: v18.2,24.5 18.2,26.1 U1.56 | v24.8,23.9 v20.4,23.9 | v34.5,13.9 34.5,11.6 35.9,11.6 36.3,11.2 36.3,10.6 U6.27
  Bottom 0.127: v18.2,24.5 18.7,24.5 19.4,23.8 20.3,23.8 v20.4,23.9 | v24.8,23.9 26.5,23.9 28.7,21.7 28.7,19.5 31.8,16.4 32,16.4 v34.5,13.9
MOTOR2_IN2  (via drill 0.3)
  Top 0.127: v18.7,25.1 18.7,26.1 U1.57 | v19.7,24.3 20,24.6 v23.3,24.6 | v32.7,17 v31.4,18.3 | v37.6,12.1 37.6,10.6 U6.25
  Bottom 0.127: v18.7,25.1 18.9,25.1 v19.7,24.3 | v23.3,24.6 26.2,24.6 29,21.8 29,20.7 v31.4,18.3 | v37.6,12.1 v32.7,17
MOTOR2_IN3  (via drill 0.3)
  Top 0.127: v22.7,25.3 20.7,25.3 20.7,26.1 U1.61 | v30.7,20.5 34.5,20.5 35.9,19.1 v35.9,16.5 | v38.9,12.8 38.9,10.6 U6.23
  Bottom 0.127: v22.7,25.3 25.9,25.3 v30.7,20.5 | v35.9,16.5 35.9,15.8 v38.9,12.8
MOTOR_D1  (via drill 0.3)
  Top 0.127: U1.3 24,29 19.8,29 v18.8,28 | v28.6,7.3 28.6,9.2 27.7,9.2 U4.26
  Bottom 0.127: v18.8,28 18.8,27.9 19.2,27.5 19.2,27.1 23.8,22.5 24.2,22.5 27.1,19.6 27.1,18 29.3,15.8 29.3,8 v28.6,7.3
MOTOR_EN  (via drill 0.3)
  Top 0.127: v12.7,36.3 12.7,35.7 U1.33 | v18.3,15.8 20,14.1 20.6,14.1 U4.10 | ARM.2 14.1,8.2 v15.1,8.2
  Bottom 0.127: v12.7,36.3 12.7,21.4 v18.3,15.8 15.1,12.6 v15.1,8.2
MOTOR_FB  (via drill 0.3)
  Top 0.127: 21.7,15.5 20.9,16.3 17.7,16.3 17.1,16.9 R7.P$2 | 21.7,15.5 21.7,15.2 U4.8 21.7,15.5 | U1.8 24,31.5 v21.6,31.5 | v33.2,19.4 32.6,18.8 25.5,18.8 23.8,17.1 23.3,17.1 21.7,15.5
  Bottom 0.127: v21.6,31.5 22,31.5 33.2,20.3 v33.2,19.4
MOTOR_SF  (via drill 0.3)
  Top 0.127: 16.8,24.8 17.2,25.2 17.2,26.1 U1.54 | 16.8,24.8 16.2,24.2 R13.P$1 | v24.2,7 24.2,8.1 U4.21 | v22,16.6 19.1,19.5 v19.1,22.4 | 16.8,24.8 v17.5,24.1
  Bottom 0.127: v24.2,7 24.2,14.4 v22,16.6 | v19.1,22.4 19.1,22.5 v17.5,24.1
N$1
  Top 0.127: U8.P$3 13,2.4 22,2.4 22.9,1.5 JW.6
N$2
  Top 0.406: JW.3 25.47,6.1 18.7,6.1 18.7,10.07 U4.15 U4.14 U4.13 U4.12
N$3
  Top 0.406: JW.1 28.01,5.81 29.3,7.1 29.3,10.1 28.8,10.1 27.7,10.07 U4.27 U4.28 U4.29 U4.30
N$4
  Top 0.254: U3.9 54.4,25.3 54.2,25.5 54.2,25.7 53.8,26.1
  Top 0.406: 53.8,26.1 53.45,26.1 L2.P$1
N$5
  Top 0.406: U4.32 28.77,14.07 29.5,14.8 C21.P$2
N$6
  Top 0.305: U5.5 50.88,3.83 51.2,3.5
  Top 0.406: 51.2,3.5 51.2,2.26 M1.1
N$7
  Top 0.305: U5.8 52.83,3.48 53,3.3
  Top 0.406: 53,3.3 53,2.7 M1.2
N$8
  Top 0.305: U5.9 53.48,3.7 54.3,3.7 55.2,2.8
  Top 0.406: 55.2,2.8 55.44,2.8 M1.3
N$9
  Top 0.305: U6.5 38.27,3.73 38.35,3.65
  Top 0.406: 38.35,3.65 M2.1
N$10
  Top 0.305: U6.8 40.23,3.77 40.4,3.6
  Top 0.406: 40.4,3.6 40.4,2.3 M2.2
N$11
  Top 0.305: U6.9 40.88,4.12 42.3,2.7
  Top 0.406: 42.3,2.7 42.54,2.7 M2.3
N$23
  Top 0.305: U1.30 C1.P$1
N$24  (via drill 0.3)
  Top 0.127: U1.7 24,31 20.5,31 16.8,27.3 13.9,27.3 v12.2,25.6 | 14.68,18.62 v14.2,19.1
  Top 0.305: C6.P$1 14.68,18.62 14.3,18.25 SWD.2
  Bottom 0.127: v12.2,25.6 12.2,21.1 v14.2,19.1
N$25
  Top 0.305: U6.1 35.67,3.92 C25.P$1
N$26
  Top 0.305: U6.2 36.33,3.62 35.2,2.5 35.2,1.95 C25.P$2
N$27
  Top 0.305: U5.2 48.92,2.92 48.5,2.5 48.5,1.75 C23.P$2
N$28
  Top 0.305: U5.1 48.27,3.02 C23.P$1
N$29
  Top 0.305: U5.3 49.58,2.42 C22.P$2
N$30
  Top 0.305: U6.3 36.98,3.23 C24.P$2
N$31  (via drill 0.3)
  Top 0.127: v13.6,25.1 U1.49 | v14.2,23.3 13.7,22.8 11.6,22.8 SWD.5
  Bottom 0.127: v13.6,25.1 13.6,23.9 v14.2,23.3
N$32  (via drill 0.3)
  Top 0.127: v14.5,29.2 12.7,29.2 U1.46 | v17.4,22.5 17.4,19.9 11.7,19.9 11.6,19.8 SWD.3
  Bottom 0.127: v14.5,29.2 14.5,26.3 17.4,23.4 v17.4,22.5
N$33  (via drill 0.3)
  Top 0.305: v20.15,27.7 U1.60
  Bottom 0.305: R1.P$2 v20.15,27.7
N$34
  Top 0.127: 25.5,37.8 25.5,39.4 R6.P$2 | U1.9 24.3,32.3 25.4,32.3 27.2,34.1 27.3,34.1 27.5,34.3 27.5,36.3 27,36.3 25.5,37.8 | 25.5,37.8 R5.P$1
N$35
  Top 0.305: U1.5 25.75,30.15 26.5,29.4 29.4,29.4 Q1.1 29.05,26.55 C8.P$1
N$36
  Top 0.305: C9.P$1 27.15,31.05 Q1.3 26.75,30.65 U1.6
N$37
  Top 0.127: D2.CATHODE 3.1,35.6 4,34.7 12.6,34.7 U1.35
N$39
  Top 0.305: R2.P$1 D1.ANODE
N$40
  Top 0.305: R3.P$1 D2.ANODE
N$41
  Top 0.305: R4.P$1 D3.ANODE
N$42
  Top 0.127: D3.CATHODE 4.9,35.6 5.3,35.2 12.6,35.2 U1.34
N$43
  Top 0.127: D1.CATHODE 2.7,34.2 12.6,34.2 U1.36
PABS_SCL
  Top 0.127: 5.8,15.65 5.8,18.2 9.4,21.8 14.8,21.8 16.6,23.6 19.2,23.6 19.2,26.1 U1.58
  Top 0.305: PABS.3 5.8,15.65 R16.P$1
PABS_SDA  (via drill 0.3)
  Top 0.127: v19.7,25.1 19.7,26.1 U1.59 | v18.2,22.6 18.2,17.6 9.7,17.6 8.4,16.3 8.4,14.3 6.5,14.3 R15.P$1
  Top 0.305: PABS.2 R15.P$1
  Route15 0.127: v19.7,25.1 18.2,23.6 v18.2,22.6
PIMU_SCL
  Top 0.127: U1.41 12.5,31.5 8.8,31.5 6.7,29.4 6.6,29.4 R18.P$1
  Top 0.305: PI.3 R18.P$1
PIMU_SDA
  Top 0.127: U1.40 12.8,32 13.4,32 15,30.4 15,27.7 6.5,27.7 R17.P$1
  Top 0.305: PI.2 R17.P$1
SLAVE_DIR  (via drill 0.3)
  Top 0.127: U2.4 43.8,25.3 43.3,25.3 U2.3 43.3,24.3 33.4,24.3 v32.8,24.9 | v22.1,34.9 19.9,32.7 12.7,32.7 U1.39
  Bottom 0.127: v32.8,24.9 32.8,25 22.9,34.9 v22.1,34.9
SLAVE_RX  (via drill 0.3)
  Top 0.127: U2.2 42.8,24.6 33.9,24.6 33.1,25.4 v31.6,25.4 | v20.8,34.4 19.6,33.2 12.7,33.2 U1.38
  Bottom 0.127: v31.6,25.4 30.5,25.4 28.4,27.5 27.7,27.5 v20.8,34.4
SLAVE_TX  (via drill 0.3)
  Top 0.127: U2.5 44.3,23.8 v36.6,23.8 | v23.1,35.4 21,35.4 19.3,33.7 12.7,33.7 U1.37
  Bottom 0.127: v36.6,23.8 36.6,24.2 36.1,24.7 33.8,24.7 v23.1,35.4

### Text on the board
tPlace: mjmech gimbal r4 | (c) 2019 / jjp@pobox.com | L | E | T